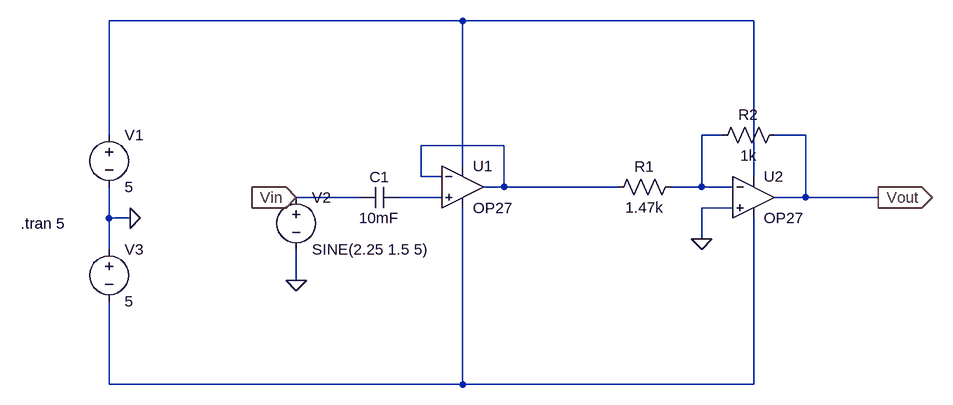
[diagram p0: schematic Output.asc]
Output.asc, the LTspice schematic file:
Version 4
SHEET 1 1248 680
WIRE 224 -96 -320 -96
WIRE 672 -96 224 -96
WIRE -320 80 -320 -96
WIRE 624 80 592 80
WIRE 752 80 704 80
WIRE 288 96 160 96
WIRE 224 128 224 -96
WIRE 160 144 160 96
WIRE 192 144 160 144
WIRE 672 144 672 -96
WIRE 288 160 288 96
WIRE 288 160 256 160
WIRE 464 160 288 160
WIRE 592 160 592 80
WIRE 592 160 544 160
WIRE 640 160 592 160
WIRE 64 176 -32 176
WIRE 192 176 128 176
WIRE 752 176 752 80
WIRE 752 176 704 176
WIRE 864 176 752 176
WIRE 640 192 592 192
WIRE -320 208 -320 160
WIRE -288 208 -320 208
WIRE 592 240 592 192
WIRE -320 256 -320 208
WIRE -32 304 -32 256
WIRE -320 464 -320 336
WIRE 224 464 224 192
WIRE 224 464 -320 464
WIRE 672 464 672 208
WIRE 672 464 224 464
FLAG -32 304 0
FLAG -32 176 Vin
IOPIN -32 176 In
FLAG 864 176 Vout
IOPIN 864 176 Out
FLAG -288 208 0
FLAG 592 240 0
SYMBOL OpAmps\\OP27 224 96 R0
SYMATTR InstName U1
SYMBOL voltage -320 64 R0
WINDOW 123 0 0 Left 0
WINDOW 39 0 0 Left 0
SYMATTR InstName V1
SYMATTR Value 5
SYMBOL voltage -32 160 R0
WINDOW 123 0 0 Left 0
WINDOW 39 0 0 Left 0
SYMATTR InstName V2
SYMATTR Value SINE(2.25 1.5 5)
SYMBOL voltage -320 240 R0
WINDOW 123 0 0 Left 0
WINDOW 39 0 0 Left 0
SYMATTR InstName V3
SYMATTR Value 5
SYMBOL cap 128 160 R90
WINDOW 0 0 32 VBottom 2
WINDOW 3 32 32 VTop 2
SYMATTR InstName C1
SYMATTR Value 10mF
SYMBOL OpAmps\\OP27 672 112 R0
SYMATTR InstName U2
SYMBOL res 560 144 R90
WINDOW 0 0 56 VBottom 2
WINDOW 3 32 56 VTop 2
SYMATTR InstName R1
SYMATTR Value 1.47k
SYMBOL res 720 64 R90
WINDOW 0 0 56 VBottom 2
WINDOW 3 32 56 VTop 2
SYMATTR InstName R2
SYMATTR Value 1k
TEXT -456 216 Left 2 !.tran 5

The netlist it stands for:
* Output.asc
XU1 N004 N003 N001 N005 N003 OP27  ; pins In+ In- V+ V- OUT
V1 N001 0 5
V2 Vin 0 SINE(2.25 1.5 5)
V3 0 N005 5
C1 N004 Vin 10mF
XU2 0 N002 N001 N005 Vout OP27  ; pins In+ In- V+ V- OUT
R1 N002 N003 1.47k
R2 Vout N002 1k
.tran 5
.lib ADI.lib
.backanno
.end